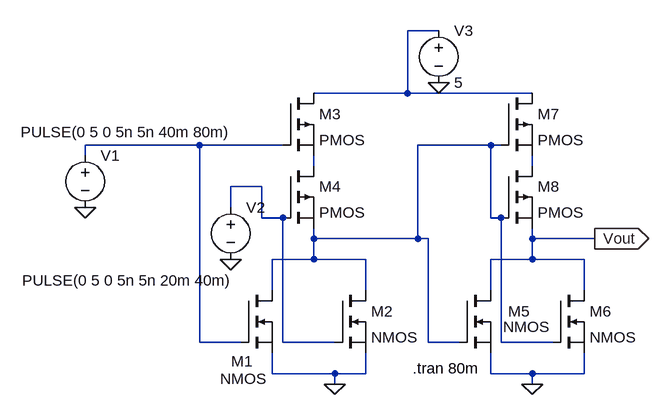
[diagram p0: schematic OR GATE.asc]
OR GATE.asc, the LTspice schematic file:
Version 4.1
SHEET 1 880 680
WIRE 384 -272 336 -272
WIRE 336 -176 336 -272
WIRE 336 -176 192 -176
WIRE 528 -176 336 -176
WIRE 16 -96 -160 -96
WIRE 144 -96 16 -96
WIRE 464 -96 352 -96
WIRE 480 -96 464 -96
WIRE -160 -80 -160 -96
WIRE 192 -64 192 -80
WIRE 528 -64 528 -80
WIRE 112 -32 64 -32
WIRE 64 0 64 -32
WIRE 112 16 112 -32
WIRE 144 16 112 16
WIRE 464 16 464 -96
WIRE 480 16 464 16
WIRE 192 48 192 32
WIRE 352 48 352 -96
WIRE 352 48 192 48
WIRE 368 48 352 48
WIRE 528 48 528 32
WIRE 624 48 528 48
WIRE 192 80 192 48
WIRE 192 80 128 80
WIRE 272 80 192 80
WIRE 528 80 528 48
WIRE 528 80 464 80
WIRE 608 80 528 80
WIRE 128 128 128 80
WIRE 272 128 272 80
WIRE 464 128 464 80
WIRE 608 128 608 80
WIRE 16 208 16 -96
WIRE 80 208 16 208
WIRE 144 208 144 16
WIRE 224 208 144 208
WIRE 368 208 368 48
WIRE 416 208 368 208
WIRE 480 208 480 16
WIRE 560 208 480 208
WIRE 128 256 128 224
WIRE 224 256 128 256
WIRE 272 256 272 224
WIRE 272 256 224 256
WIRE 464 256 464 224
WIRE 528 256 464 256
WIRE 608 256 608 224
WIRE 608 256 528 256
WIRE 224 272 224 256
WIRE 528 272 528 256
FLAG 224 272 0
FLAG 528 272 0
FLAG 624 48 Vout
IOPIN 624 48 Out
FLAG 384 -192 0
FLAG -160 0 0
FLAG 64 80 0
SYMBOL nmos 80 128 R0
WINDOW 0 -15 109 Left 2
WINDOW 3 -32 136 Left 2
SYMATTR InstName M1
SYMBOL nmos 224 128 R0
SYMATTR InstName M2
SYMBOL pmos 144 -176 R0
SYMATTR InstName M3
SYMBOL pmos 144 -64 R0
SYMATTR InstName M4
SYMBOL nmos 416 128 R0
WINDOW 0 75 32 Left 2
WINDOW 3 67 56 Left 2
SYMATTR InstName M5
SYMBOL nmos 560 128 R0
SYMATTR InstName M6
SYMBOL pmos 480 -176 R0
SYMATTR InstName M7
SYMBOL pmos 480 -64 R0
SYMATTR InstName M8
SYMBOL voltage -160 -96 R0
WINDOW 3 -99 -20 Left 2
WINDOW 123 0 0 Left 0
WINDOW 39 0 0 Left 0
SYMATTR InstName V1
SYMATTR Value PULSE(0 5 0 5n 5n 40m 80m)
SYMBOL voltage 64 -16 R0
WINDOW 3 -321 128 Left 2
WINDOW 123 0 0 Left 0
WINDOW 39 0 0 Left 0
SYMATTR InstName V2
SYMATTR Value PULSE(0 5 0 5n 5n 20m 40m)
SYMBOL voltage 384 -288 R0
WINDOW 123 0 0 Left 0
WINDOW 39 0 0 Left 0
SYMATTR InstName V3
SYMATTR Value 5
TEXT 344 248 Left 2 !.tran 80m

The netlist it stands for:
* OR GATE.asc
M1 N003 N002 0 0 NMOS
M2 N003 N006 0 0 NMOS
M3 N001 N002 N004 N004 PMOS
M4 N004 N006 N003 N003 PMOS
M5 Vout N003 0 0 NMOS
M6 Vout N003 0 0 NMOS
M7 N001 N003 N005 N005 PMOS
M8 N005 N003 Vout Vout PMOS
V1 N002 0 PULSE(0 5 0 5n 5n 40m 80m)
V2 N006 0 PULSE(0 5 0 5n 5n 20m 40m)
V3 N001 0 5
.model NMOS NMOS
.model PMOS PMOS
.lib standard.mos
.tran 80m
.backanno
.end